# EAGLE design thermostat (EAGLE 7.7.0)
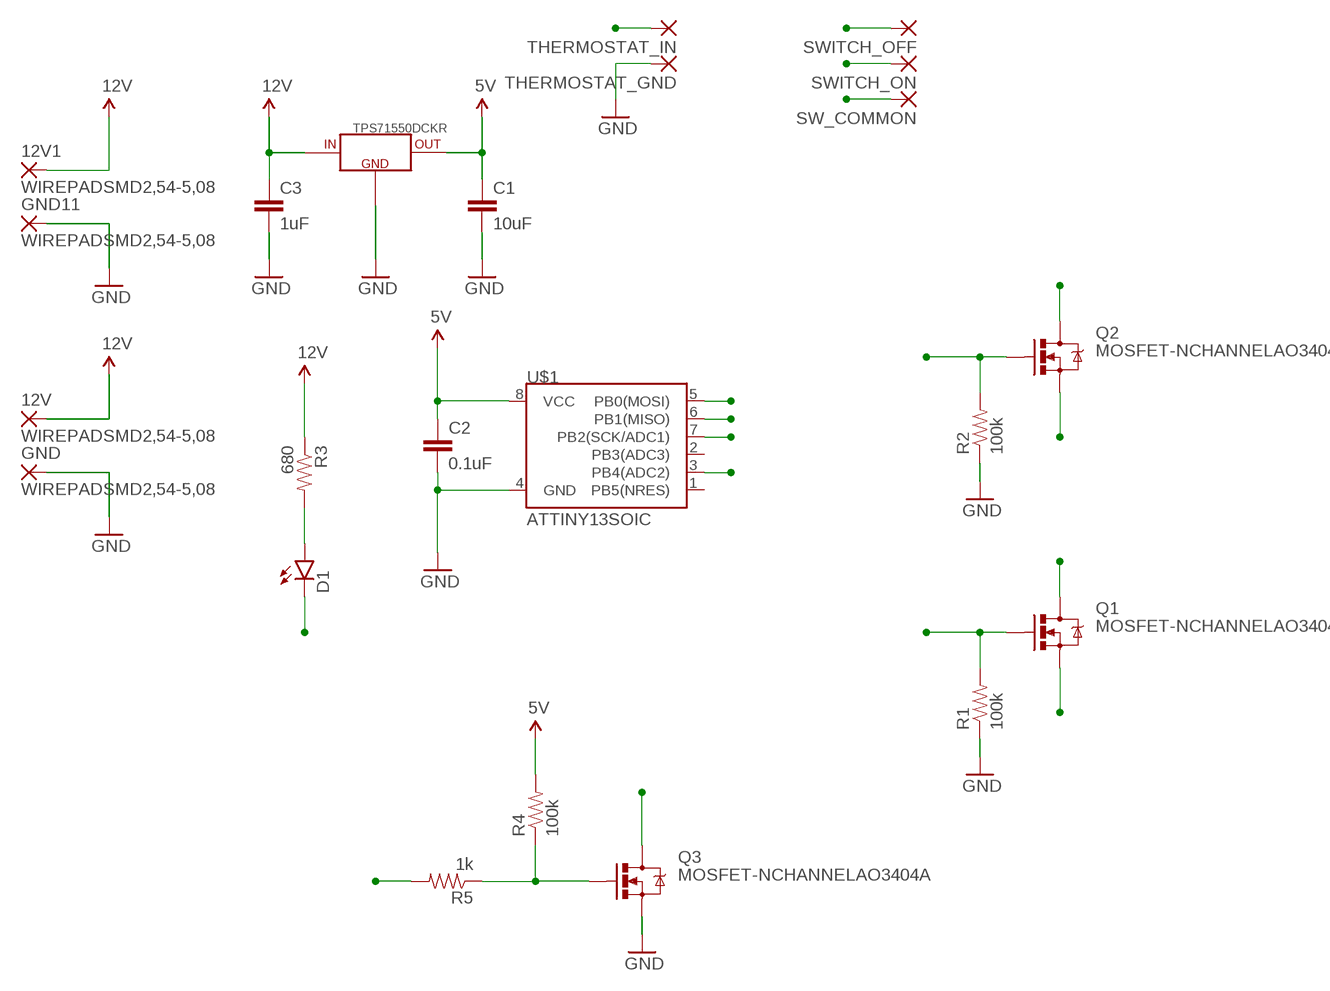
[diagram p0: schematic, sheet 1]

## Parts
12V  WIREPADSMD2,54-5,08  [SMD2,54-5,08]
12V1  WIREPADSMD2,54-5,08  [SMD2,54-5,08]
C1  10uF  CAP1210  [1210]
C2  0.1uF  CAP0805  [0805]
C3  1uF  CAP1210  [1210]
D1  LED0603  [LED-0603]
GND  WIREPADSMD2,54-5,08  [SMD2,54-5,08]
GND11  WIREPADSMD2,54-5,08  [SMD2,54-5,08]
Q1  MOSFET-NCHANNELAO3404A  [SOT23-3]
Q2  MOSFET-NCHANNELAO3404A  [SOT23-3]
Q3  MOSFET-NCHANNELAO3404A  [SOT23-3]
R1  100k  RESISTOR0805-RES  [0805]
R2  100k  RESISTOR0805-RES  [0805]
R3  680  RESISTOR0805-RES  [0805]
R4  100k  RESISTOR0805-RES  [0805]
R5  1k  RESISTOR0805-RES  [0805]
SW_COMMON  WIREPADSMD2,54-5,08  [SMD2,54-5,08]
SWITCH_OFF  WIREPADSMD2,54-5,08  [SMD2,54-5,08]
SWITCH_ON  WIREPADSMD2,54-5,08  [SMD2,54-5,08]
THERMOSTAT_GND  WIREPADSMD2,54-5,08  [SMD2,54-5,08]
THERMOSTAT_IN  WIREPADSMD2,54-5,08  [SMD2,54-5,08]
TPS71550DCKR  TPS715XX  [SC70-5]
U$1  ATTINY13SOIC  [SO08]

## Nets
5V: C1.1 C2.1 R4.2 TPS71550DCKR.5(OUT) U$1.8(VCC)
12V: 12V1.1(P) 12V.1(P) C3.1 R3.1 TPS71550DCKR.4(IN)
GND: C1.2 C2.2 C3.2 GND11.1(P) GND.1(P) Q3.2(S) R1.1 R2.1 THERMOSTAT_GND.1(P) TPS71550DCKR.2(GND) U$1.4(GND)
HEAT_OFF: Q2.1(G) R2.2 U$1.5(PB0(MOSI))
HEAT_ON: Q1.1(G) R1.2 U$1.6(PB1(MISO))
LED: D1.C U$1.3(PB4(ADC2))
N$1: Q3.1(G) R4.1 R5.1
N$2: D1.A R3.2
SENSOR_IN: Q3.3(D) U$1.7(PB2(SCK/ADC1))
SW_COMMON: Q1.3(D) Q2.3(D) SW_COMMON.1(P)
SWITCH_OFF: Q2.2(S) SWITCH_OFF.1(P)
SWITCH_ON: Q1.2(S) SWITCH_ON.1(P)
THERMOSTAT_IN: R5.2 THERMOSTAT_IN.1(P)
Unconnected: U$1.1(PB5(NRES)) U$1.2(PB3(ADC3))

## Library data of the parts
12V 12V1 GND GND11 SW_COMMON SWITCH_OFF SWITCH_ON THERMOSTAT_GND THERMOSTAT_IN = wirepad:WIREPAD: Wire PAD connect wire on PCB
C1-C3 = SparkFun-Capacitors:CAP: Capacitor Standard 0603 ceramic capacitor, and 0.1" leaded capacitor.
D1 = SparkFun-LED:LED: LEDs Standard schematic elements and footprints for 5mm, 3mm, 1206, and 0603 sized LEDs. 5mm - Spark Fun Electronics SKU : COM-00529 (and others)
Q1-Q3 = SparkFun-DiscreteSemi:MOSFET-NCHANNEL: Common NMOSFET Parts MFG P/N Store ID Prod ID FDD8780 TRANS-09984 SI7820DN TRANS-11055 FDS6630A IC-08089 2N7002PW TRANS-11151 FQP30N06L COM-10213 TRANS-10060 BSS123LT1G TRANS-08345 BSS138 TRANS-00830 BS170 2N7000; PROD_ID: TRAN-12988
R1-R5 = SparkFun-Passives:RESISTOR: Resistor Basic schematic elements and footprints for 0603, 1206, and PTH resistors.
TPS71550DCKR = Synapseware:TPS715XX: 50 mA, 24 V, 3.2-uA Supply Current Low-Dropout Linear Regulator in SC70 (SOT-323) Package TPS71550DCKR - 5.0V version TPS71533DCKR - 3.3V version TPS71525DCKR - 2.5V version
U$1 = SparkFun-DigitalIC:ATTINY13: Atmel 8-pin 1kB flash uC

## Board
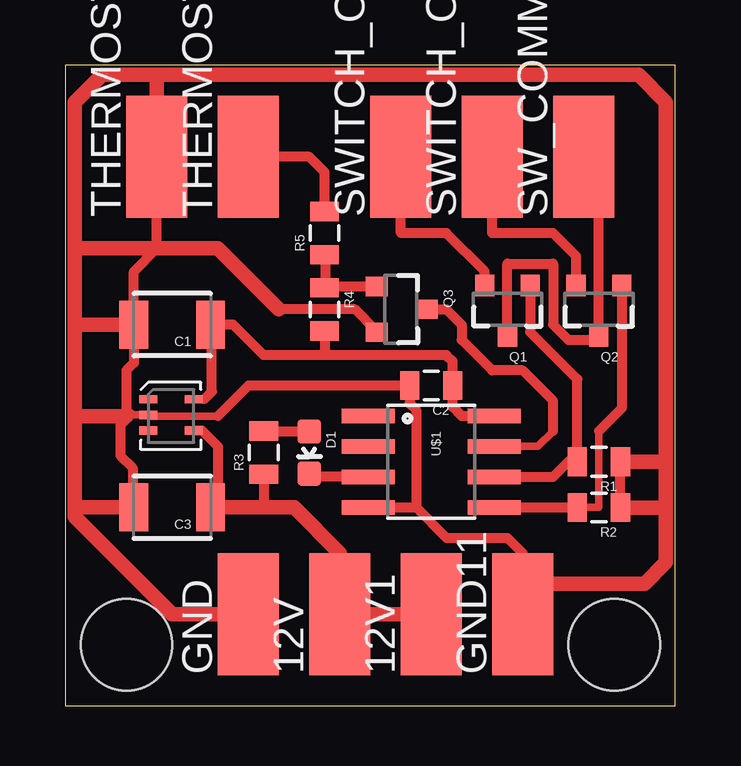
[diagram p1: board, top side]

Size 25.4 x 26.67 mm. Coordinates in mm from the lower left corner, seen from the top.
Outline: 0,0 25.4,0 25.4,26.67 0,26.67 0,0
Copper layers (1*16): Top 0.035mm / dielectric 1.5mm / Bottom 0.035mm
Design rules "default": minimum track width 10mil, minimum drill 0.6mm, track to track 8mil, track to pad 8mil, pad to pad 8mil, via to via 8mil, smd to smd 8mil, copper to edge 40mil, drill to drill 8mil, minimum pad ring 10mil, minimum via ring 8mil, stop-mask expansion 4mil, vias tented up to drill 0mil, thermal gap 10mil
Holes 3.81 mm at 2.54,2.54 22.86,2.54

### Footprints (pad centres in the part's own frame; a part is rotated, then mirrored left to right if it is on the bottom)
SMD2,54-5,08 = smd 2.54 x 5.08: 1 0,0
1210 = smd 1.2 x 2: 1 -1.6,0; 2 1.6,0
0805 = smd 0.8 x 1.2: 1 -0.9,0; 2 0.9,0
LED-0603 = smd 1 x 1: A 0,-0.877; C 0,0.877
SOT23-3 = smd 0.8 x 0.9: 1 -0.95,-1; 2 0.95,-1; 3 0,1.1
SC70-5 = smd 0.35 x 0.75: 1 -0.7,-1; 2 -0.05,-1; 3 0.6,-1; 4 0.6,0.9; 5 -0.7,0.9
SO08 = smd 0.61 x 2.21: 1 -1.905,-2.616; 2 -0.635,-2.616; 3 0.635,-2.616; 4 1.905,-2.616; 5 1.905,2.616; 6 0.635,2.616; 7 -0.635,2.616; 8 -1.905,2.616

### Placement (x,y rotation side)
12V  11.43,3.81 0 top
12V1  15.24,3.81 0 top
C1  4.45,15.88 180 top
C2  15.24,13.34 180 top
C3  4.45,8.26 180 top
D1  10.16,10.54 180 top
GND  7.62,3.81 0 top
GND11  19.05,3.81 0 top
Q1  18.41,16.51 180 top
Q2  22.23,16.51 180 top
Q3  13.97,16.51 270 top
R1  22.23,10.16 180 top
R2  22.23,8.26 180 top
R3  8.26,10.54 90 top
R4  10.79,16.51 270 top
R5  10.79,19.68 90 top
SW_COMMON  21.59,22.86 0 top
SWITCH_OFF  17.78,22.86 0 top
SWITCH_ON  13.97,22.86 0 top
THERMOSTAT_GND  3.81,22.86 0 top
THERMOSTAT_IN  7.62,22.86 0 top
TPS71550DCKR  4.45,12.06 270 top
U$1  15.24,10.16 270 top

### Tracks (layer width: path | path; a pad name or v marks a point on that pad's centre or on a via)
5V
  Top 0.305: TPS71550DCKR.5 5.78,12.77 | 6.1,15.82 C1.1
  Top 0.406: U$1.8 16.51,12.06 16.13,12.45 16.13,13.32 | 16.13,13.32 C2.1 | 5.78,12.77 6.1,13.08 6.1,15.82 | 16.13,13.32 16.13,14.35 15.88,14.61 10.79,14.61 | 10.79,14.61 8.26,14.61 6.99,15.88 C1.1 | R4.2 10.79,14.61
12V
  Top 0.406: TPS71550DCKR.4 5.68,11.46 6.35,10.79 6.35,8.56 C3.1 | R3.1 8.26,8.26
  Top 0.61: C3.1 8.26,8.26 9.53,8.26 11.43,6.35 12V.1 12V1.1
GND
  Top 0.305: 2.72,12.12 TPS71550DCKR.2 3.5,12.06 6.35,12.06 | 2.79,8.31 C3.2
  Top 0.406: 2.79,8.31 2.79,9.91 2.29,10.41 2.29,11.68 2.72,12.12 2.54,12.29 2.54,13.97 2.85,14.28 C1.2 2.85,18.09 3.81,19.05 THERMOSTAT_GND.1 | 14.61,8.26 14.61,12.32 14.34,12.58 C2.2 7.62,13.34 6.35,12.06 | R1.1 R2.1 23.11,8.24 | U$1.4 14.61,8.26 | 14.61,8.26 15.88,6.99 18.41,6.99 19.05,6.35 19.05,5.08 GND11.1 | Q3.2 12.97,15.61 12.06,16.51 8.89,16.51
  Top 0.61: GND.1 4.45,3.81 0.38,7.87 0.38,25.15 1.52,26.29 23.88,26.29 25.02,25.15 25.02,8.26 | 25.02,8.26 25.02,5.97 24.13,5.08 19.05,5.08 | 23.11,8.24 24.75,8.24 25.02,8.26 | 0.64,19.05 3.81,19.05 6.35,19.05 8.89,16.51
HEAT_OFF
  Top 0.305: R2.2 22.23,8.26 22.23,11.43
  Top 0.406: U$1.5 R2.2 | Q2.1 23.18,12.38 22.23,11.43
HEAT_ON
  Top 0.406: U$1.6 20.32,9.53 20.95,10.16 R1.2 21.32,13.6 19.36,15.56 Q1.1
LED
  Top 0.406: U$1.3 10.29,9.53 10.17,9.65 D1.C
N$1
  Top 0.406: Q3.1 10.85,17.46 | 10.85,17.46 R4.1 | 10.85,17.46 10.85,18.73 R5.1
N$2
  Top 0.406: D1.A 8.28,11.42 R3.2
N$3
  Top 0.61: 23.5,10.16 24.77,10.16
N$4
  Top 0.61: 2.54,12.06 0.64,12.06
N$5
  Top 0.61: 2.54,15.88 0.64,15.88
N$6
  Top 0.61: 2.54,8.26 0.64,8.26
N$7
  Top 0.61: 3.81,26.04 3.81,24.77
SENSOR_IN
  Top 0.305: U$1.7 19.68,10.79 20.32,11.43
  Top 0.406: 20.32,11.43 20.32,12.7 19.05,13.97 17.78,13.97 16.51,15.24 16.51,15.88 15.88,16.51 Q3.3
SW_COMMON
  Top 0.406: Q1.3 18.41,18.41 20.32,18.41 20.32,15.88 20.95,15.24 22.05,15.24 Q2.3 22.23,20.95 SW_COMMON.1
SWITCH_OFF
  Top 0.406: Q2.2 21.27,18.73 20.32,19.68 17.78,19.68 SWITCH_OFF.1
SWITCH_ON
  Top 0.406: Q1.2 17.46,18.09 15.88,19.68 13.97,19.68 SWITCH_ON.1
THERMOSTAT_IN
  Top 0.406: R5.2 10.79,22.23 10.16,22.86 THERMOSTAT_IN.1